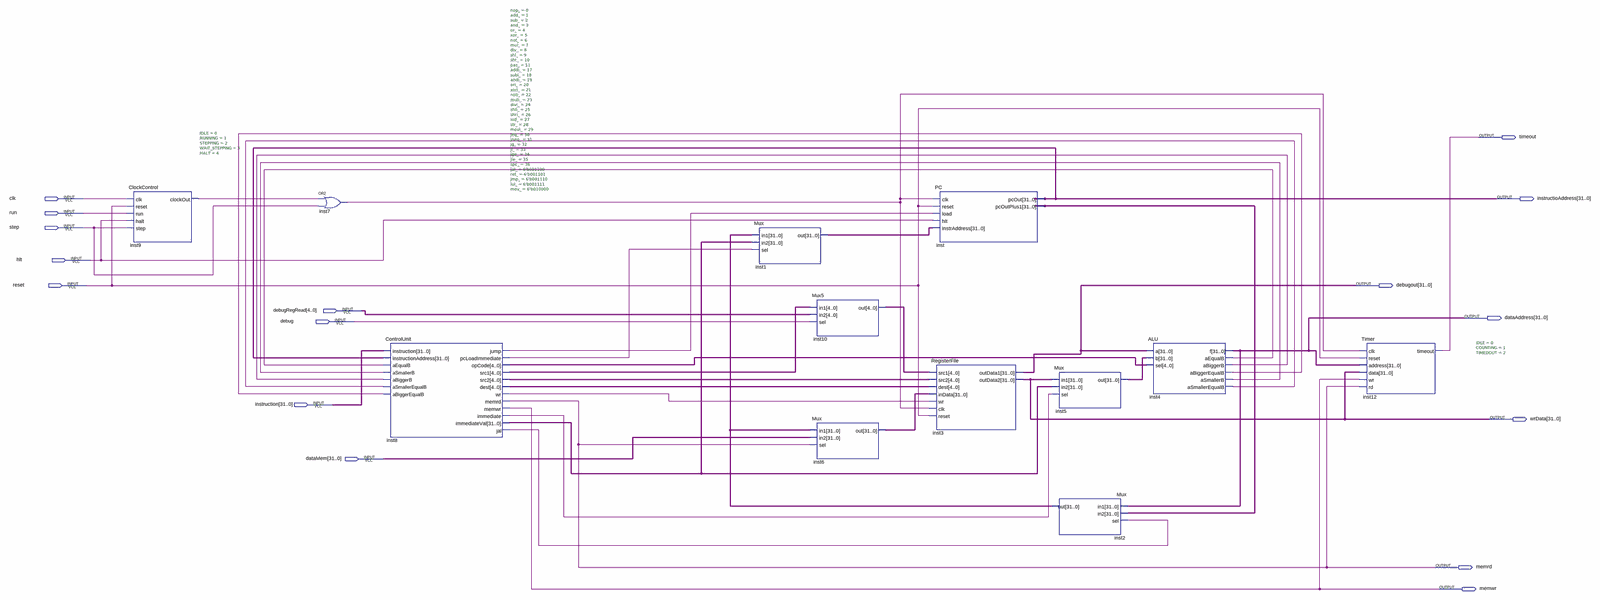
[diagram p0: schematic sheet, whole]
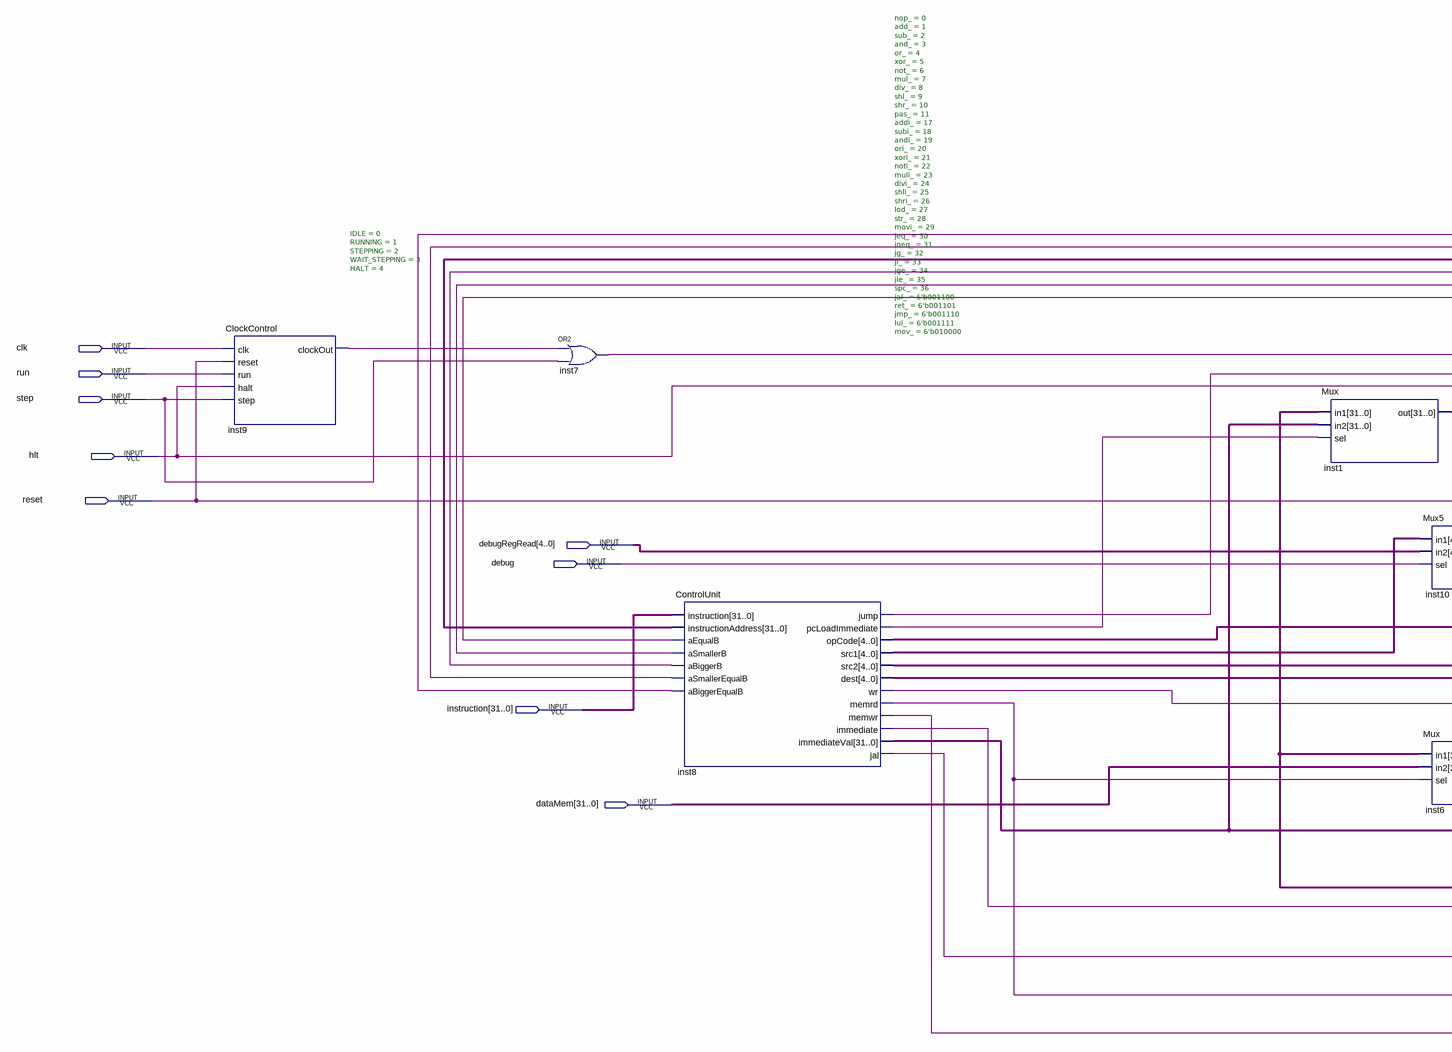
[diagram p1: schematic sheet, left part]
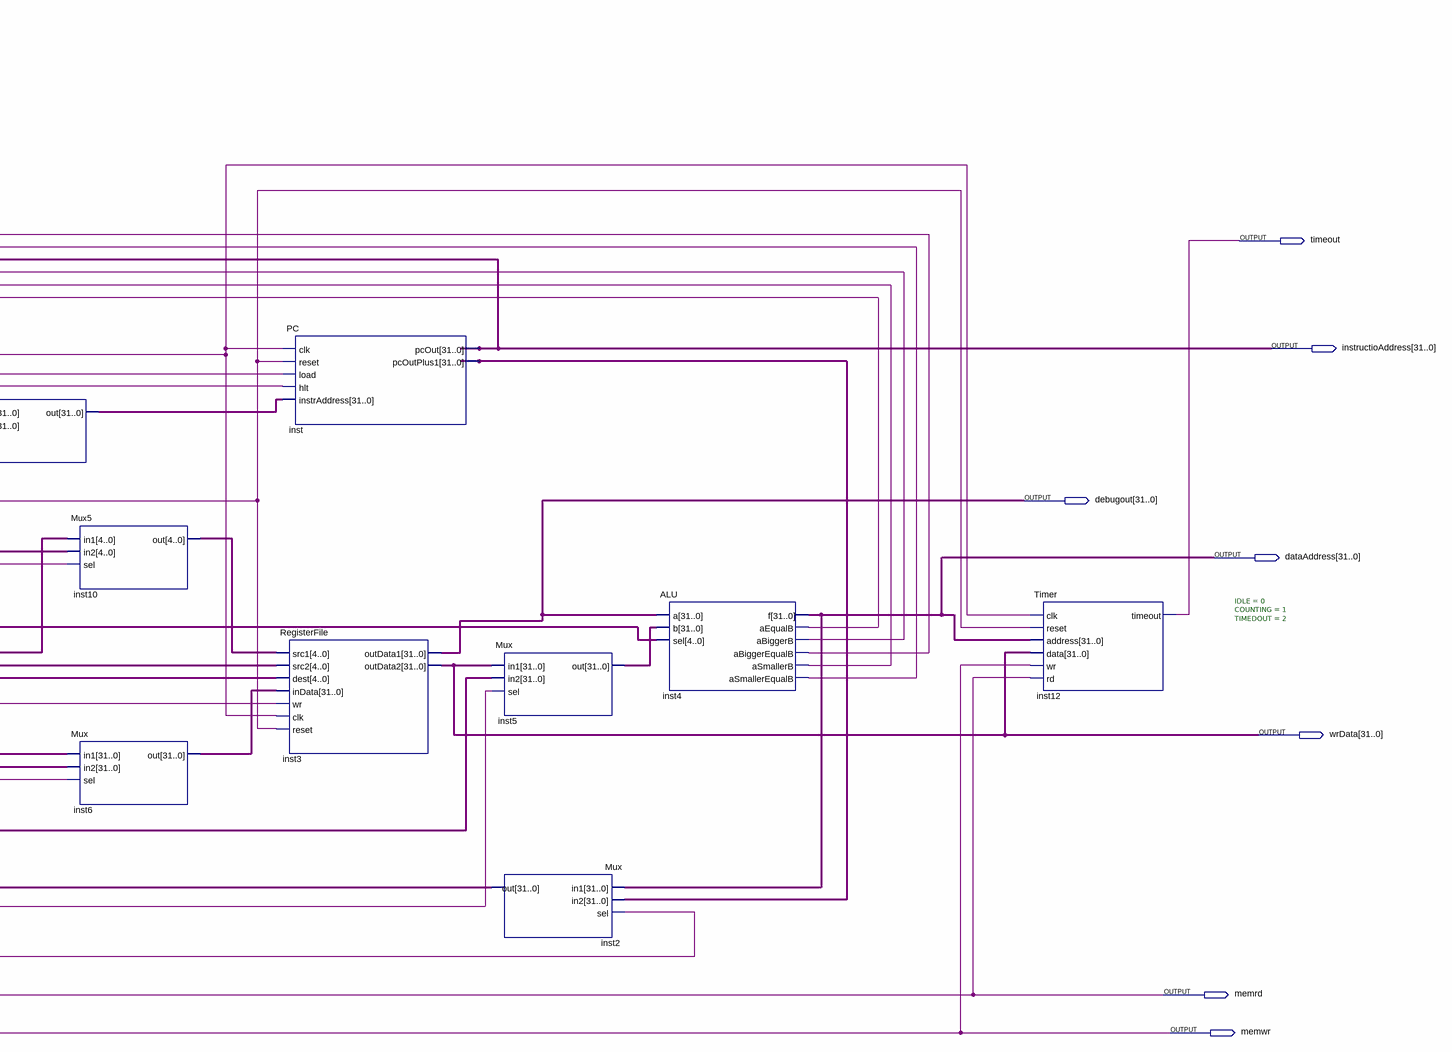
[diagram p2: schematic sheet, right part]
// Quartus schematic Processor.bdf as structural Verilog: 12 symbols, 16 pins
module Processor (
  input  clk,
  input  run,
  input  step,
  input  hlt,
  input  reset,
  input  [4:0] debugRegRead,
  input  debug,
  input  [31:0] instruction,
  input  [31:0] dataMem,
  output timeout,
  output [31:0] instructioAddress,
  output [31:0] debugout,
  output [31:0] dataAddress,
  output [31:0] wrData,
  output memrd,
  output memwr
);

  wire inst4_abiggerb, inst4_abiggerequalb, inst4_aequalb, inst4_asmallerb, inst4_asmallerequalb, inst7_out,
       inst8_immediate, inst8_jal, inst8_jump, inst8_pcloadimmediate, inst8_wr, inst9_clockout;
  wire [4:0] inst8_dest, inst8_opcode, inst8_src1, inst8_src2, inst10_out;
  wire [31:0] inst1_out, inst2_out, inst5_out, inst6_out, inst8_immediateval, inst_pcoutplus1;

  ClockControl #(.IDLE(0), .RUNNING(1), .STEPPING(2), .WAIT_STEPPING(3), .HALT(4)) inst9 (
    .clk(clk), .reset(reset), .run(run), .halt(hlt), .step(step), .clockOut(inst9_clockout));
  or inst7 (inst7_out, inst9_clockout, step);
  ControlUnit #(.nop_(0), .add_(1), .sub_(2), .and_(3), .or_(4), .xor_(5), .not_(6), .mul_(7), .div_(8), .shl_(9), .shr_(10), .pas_(11), .addi_(17), .subi_(18), .andi_(19), .ori_(20), .xori_(21), .noti_(22), .muli_(23), .divi_(24), .shli_(25), .shri_(26), .lod_(27), .str_(28), .movi_(29), .jeq_(30), .jneq_(31), .jg_(32), .jl_(33), .jge_(34), .jle_(35), .spc_(36), .jal_(6'b001100), .ret_(6'b001101), .jmp_(6'b001110), .lui_(6'b001111), .mov_(6'b010000)) inst8 (
    .instruction(instruction), .instructionAddress(instructioAddress), .aEqualB(inst4_aequalb),
    .aSmallerB(inst4_asmallerb), .aBiggerB(inst4_abiggerb), .aSmallerEqualB(inst4_asmallerequalb),
    .aBiggerEqualB(inst4_abiggerequalb), .jump(inst8_jump), .pcLoadImmediate(inst8_pcloadimmediate),
    .opCode(inst8_opcode), .src1(inst8_src1), .src2(inst8_src2), .dest(inst8_dest), .wr(inst8_wr),
    .memrd(memrd), .memwr(memwr), .immediate(inst8_immediate), .immediateVal(inst8_immediateval),
    .jal(inst8_jal));
  Mux inst1 (.in1(inst2_out), .in2(inst8_immediateval), .sel(inst8_pcloadimmediate), .out(inst1_out));
  Mux5 inst10 (.in1(inst8_src1), .in2(debugRegRead), .sel(debug), .out(inst10_out));
  Mux inst6 (.in1(inst2_out), .in2(dataMem), .sel(memrd), .out(inst6_out));
  RegisterFile inst3 (
    .src1(inst10_out), .src2(inst8_src2), .dest(inst8_dest), .inData(inst6_out), .wr(inst8_wr),
    .clk(inst7_out), .reset(reset), .outData1(debugout), .outData2(wrData));
  PC inst (
    .clk(inst7_out), .reset(reset), .load(inst8_jump), .hlt(hlt), .instrAddress(inst1_out),
    .pcOut(instructioAddress), .pcOutPlus1(inst_pcoutplus1));
  Mux inst5 (.in1(wrData), .in2(inst8_immediateval), .sel(inst8_immediate), .out(inst5_out));
  Mux inst2 (.in1(dataAddress), .in2(inst_pcoutplus1), .sel(inst8_jal), .out(inst2_out));
  ALU inst4 (
    .a(debugout), .b(inst5_out), .sel(inst8_opcode), .f(dataAddress), .aEqualB(inst4_aequalb),
    .aBiggerB(inst4_abiggerb), .aBiggerEqualB(inst4_abiggerequalb), .aSmallerB(inst4_asmallerb),
    .aSmallerEqualB(inst4_asmallerequalb));
  Timer #(.IDLE(0), .COUNTING(1), .TIMEDOUT(2)) inst12 (
    .clk(inst7_out), .reset(reset), .address(dataAddress), .data(wrData), .wr(memwr), .rd(memrd),
    .timeout(timeout));
endmodule
